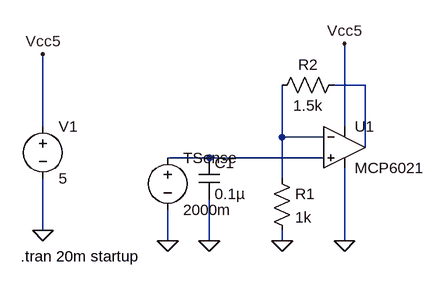
[diagram p0: schematic laser_sense.asc]
laser_sense.asc, the LTspice schematic file:
Version 4
SHEET 1 880 680
WIRE 512 16 464 16
WIRE 16 80 16 -32
WIRE 480 80 480 -48
WIRE 384 96 384 16
WIRE 448 96 384 96
WIRE 512 112 512 16
WIRE 272 128 208 128
WIRE 448 128 272 128
WIRE 384 160 384 96
WIRE 16 240 16 160
WIRE 208 256 208 208
WIRE 272 256 272 192
WIRE 384 256 384 240
WIRE 480 256 480 144
FLAG 16 240 0
FLAG 16 -32 Vcc5
FLAG 480 256 0
FLAG 480 -48 Vcc5
FLAG 384 256 0
FLAG 208 256 0
FLAG 272 256 0
SYMBOL voltage 16 64 R0
SYMATTR InstName V1
SYMATTR Value 5
SYMBOL SBORKA\\OPamp\\MCP6021 480 112 R0
SYMATTR InstName U1
SYMBOL voltage 208 112 R0
SYMATTR InstName TSense
SYMATTR Value 2000m
SYMBOL res 368 144 R0
SYMATTR InstName R1
SYMATTR Value 1k
SYMBOL res 480 0 R90
WINDOW 0 0 56 VBottom 2
WINDOW 3 32 56 VTop 2
SYMATTR InstName R2
SYMATTR Value 1.5k
SYMBOL cap 256 128 R0
SYMATTR InstName C1
SYMATTR Value 0.1µ
TEXT -18 280 Left 2 !.tran 20m startup

The netlist it stands for:
* laser_sense.asc
V1 Vcc5 0 5
* U1: MCP6021 (symbol SBORKA\OPamp\MCP6021 not available, pins judged from their places): In+=N003 In-=N002 V+=Vcc5 V-=0 OUT=N001
V§TSense N003 0 2000m
R1 N002 0 1k
R2 N001 N002 1.5k
C1 N003 0 0.1µ
.tran 20m startup
.backanno
.end